# Altium project PROC114E3_SCH.PrjPcb (part 8 of 22)

## Sheet 20.SchDoc
size 513 x 386 mm
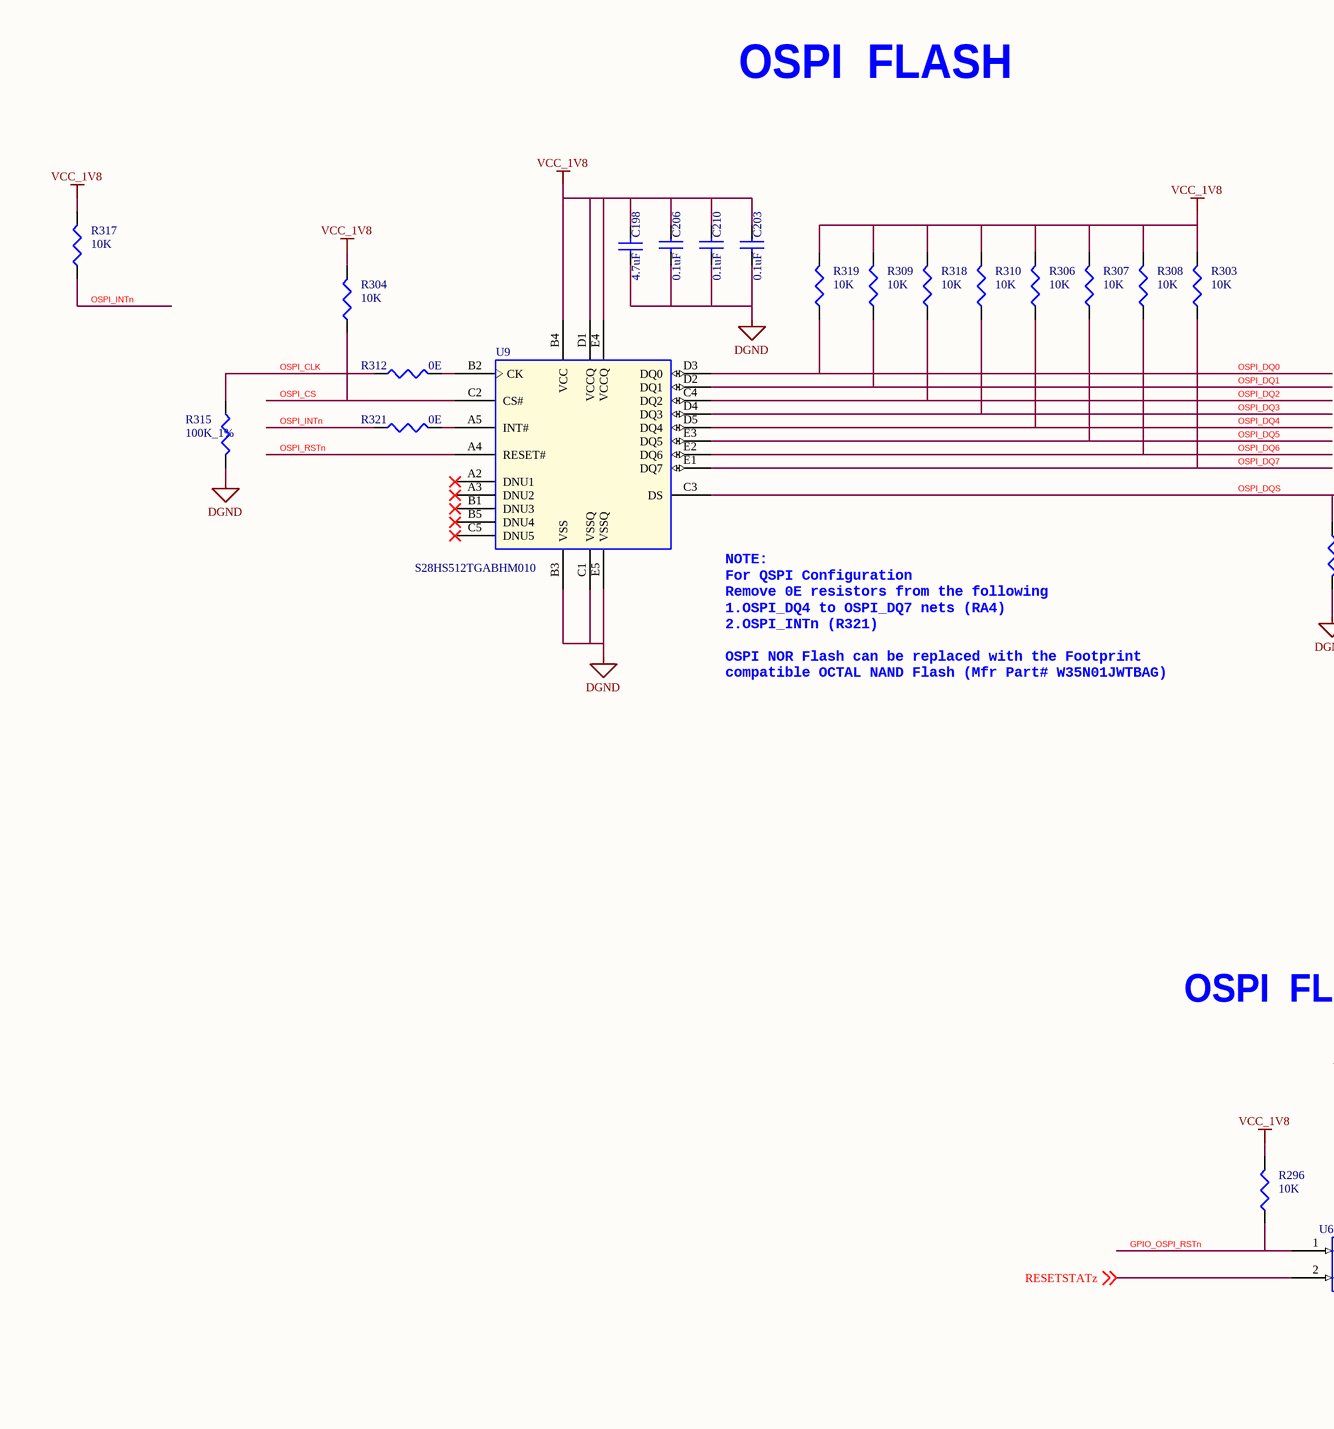
[diagram p30: 20.SchDoc, left]
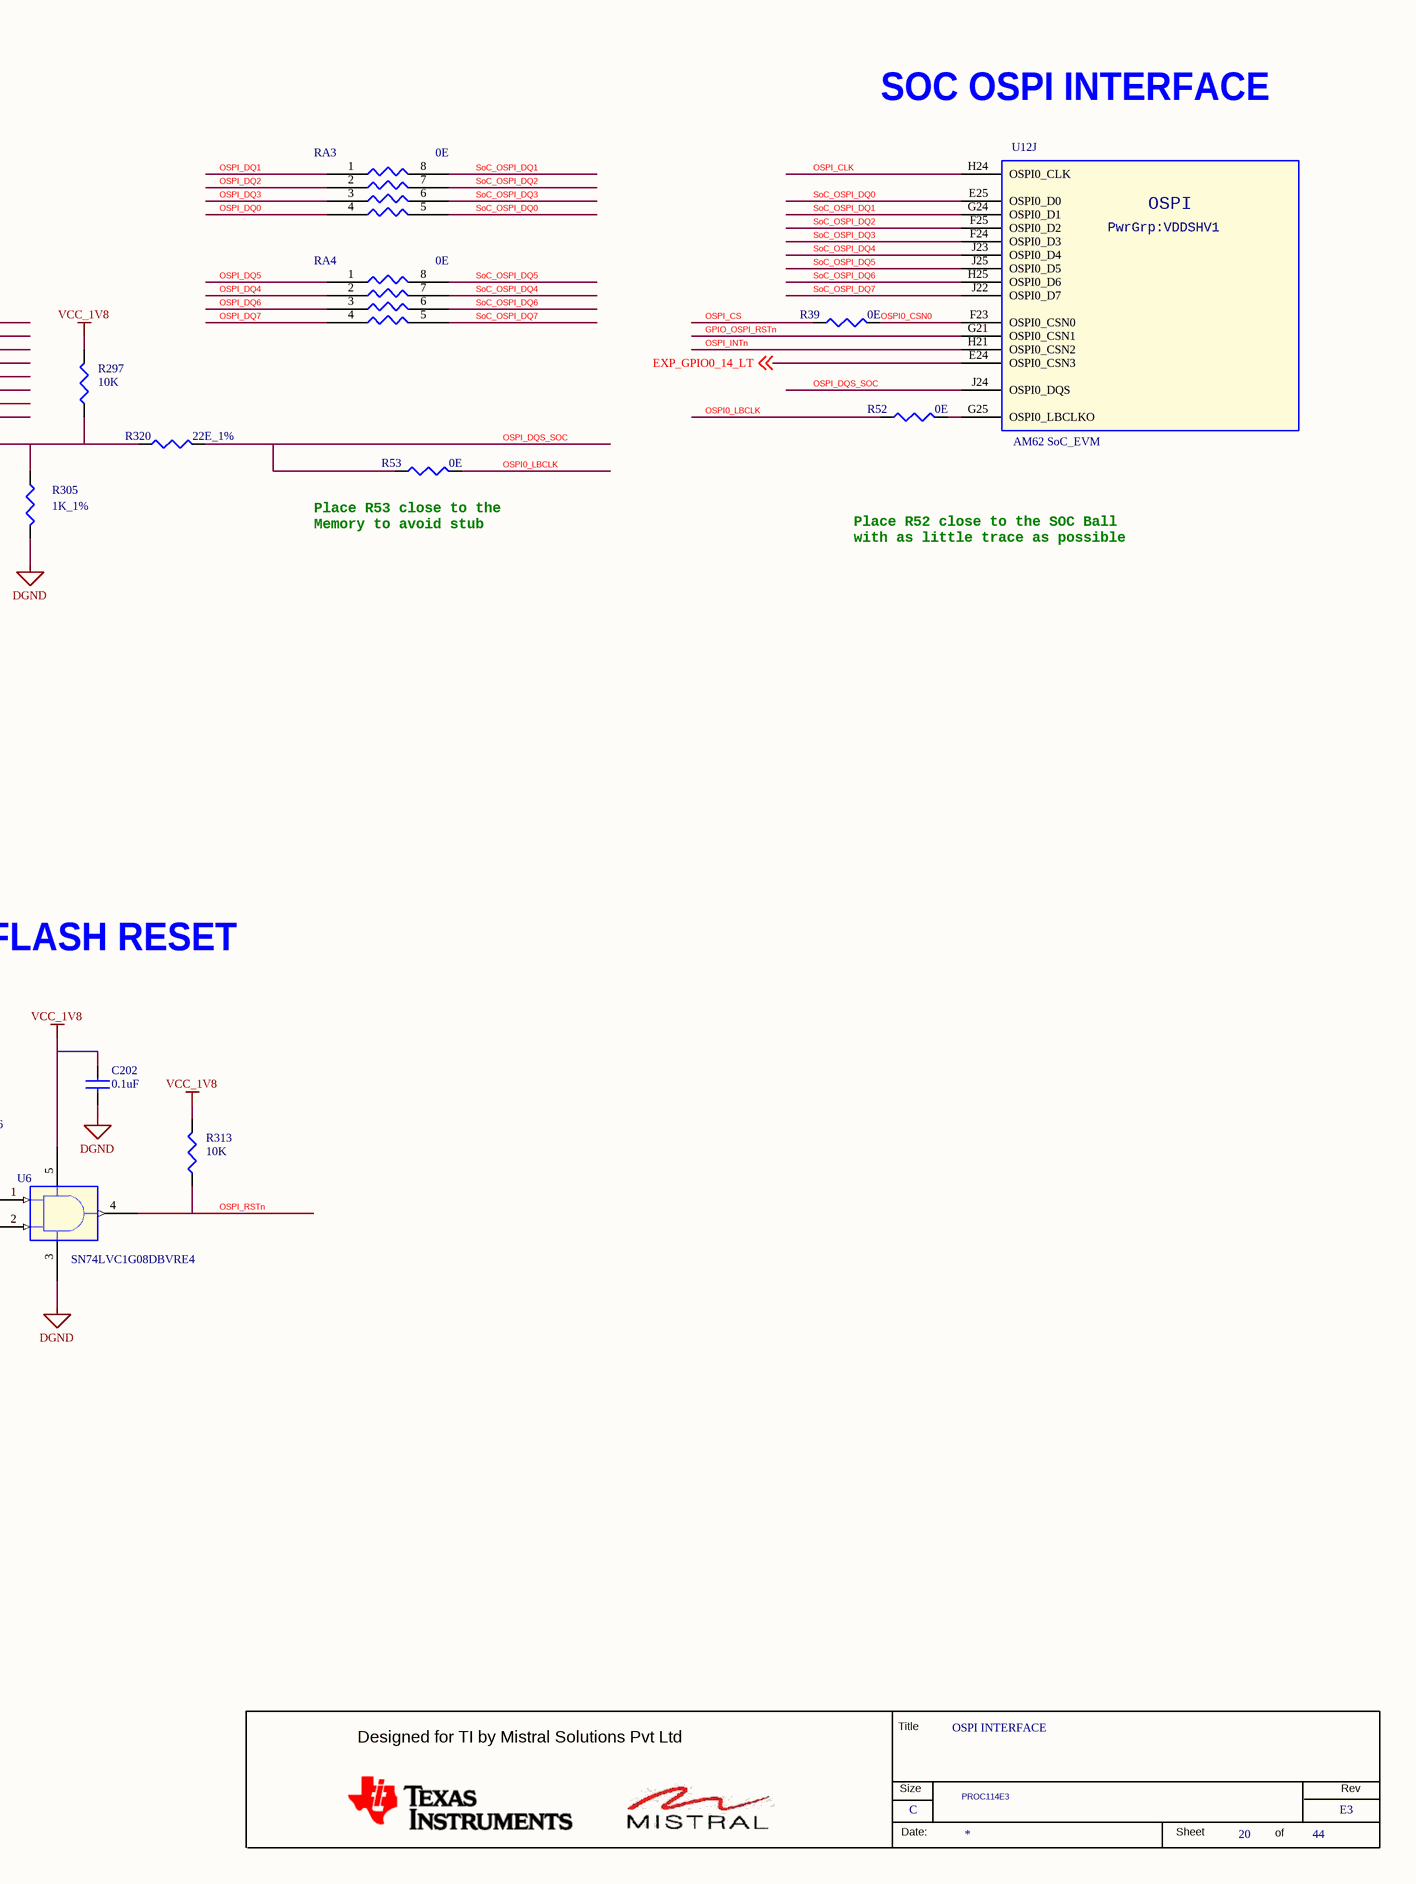
[diagram p31: 20.SchDoc, right]

### Parts
(Parts that share a designator on the sheet are numbered #1, #2 ... from top to bottom, then left to right.)
*#20  RevCode: E3  Title: OSPI INTERFACE  Page Size: C  Page Number: 20  Page Count: 44  Variant Name: PROC114E3  (hidden comment: MISTRAL_TITLEBLK_CSIZE)  (graphical)
C198  4.7uF  [CAP0402_0-75]
C202  0.1uF  [CAP0402_0-75]
C203  0.1uF  [CAP0402_0-75]
C206  0.1uF  [CAP0402_0-75]
C210  0.1uF  [CAP0402_0-75]
R39  0E  [RES0201_0-5]
R52  0E  [RES0201_0-5]
R53  0E  [RES0201_0-5]
R296  10K  [RES0201_0-5]
R297  10K  [RES0201_0-5]
R303  10K  [RES0201_0-5]
R304  10K  [RES0201_0-5]
R305  1K_1%  [RES0402_0-5]
R306  10K  [RES0201_0-5]
R307  10K  [RES0201_0-5]
R308  10K  [RES0201_0-5]
R309  10K  [RES0201_0-5]
R310  10K  [RES0201_0-5]
R312  0E  [RES0402_0-5]
R313  10K  [RES0201_0-5]
R315  100K_1%  [RES0201_0-5]
R317  10K  [RES0201_0-5]
R318  10K  [RES0201_0-5]
R319  10K  [RES0201_0-5]
R320  22E_1%  [RES0201_0-5]
R321  0E  [RES0402_0-5]
RA3  0E  [RESA_EXB_0201-4_0-5]
RA4  0E  [RESA_EXB_0201-4_0-5]
U6  SN74LVC1G08DBVRE4  [SOT23-5]
U9  S28HS512TGABHM010  [BGA24_39-37_240X310_1]
U12#2  AM62 SoC_EVM  [BGA425_19-68_510X510_0-7]  (part J of 18)

### Nets
DGND: C198.1 C202.2 C203.2 C206.2 C210.2 R305.2 R315.2 U6.3(GND) U9.B3(VSS) U9.C1(VSSQ) U9.E5(VSSQ)
VCC_1V8: C198.2 C202.1 C203.1 C206.1 C210.1 R296.2 R297.2 R303.2 R304.2 R306.2 R307.2 R308.2 R309.2 R310.2 R313.2 R317.2 R318.2 R319.2 U6.5(VCC) U9.B4(VCC) U9.D1(VCCQ) U9.E4(VCCQ)
EXP_GPIO0_14_LT: U12#2.E24(OSPI0_CSN3) ; off-sheet EXP_GPIO0_14_LT
GPIO_OSPI_RSTn: R296.1 U6.1(A) U12#2.G21(OSPI0_CSN1)
OSPI0_CSN0: R39.2 U12#2.F23(OSPI0_CSN0)
OSPI0_LBCLK: R52.1 R53.2
OSPI_CLK: R312.1 R315.1 U12#2.H24(OSPI0_CLK)
OSPI_CS: R39.1 R304.1 U9.C2(CS#)
OSPI_DQ0: R319.1 RA3.4 U9.D3(DQ0)
OSPI_DQ1: R309.1 RA3.1 U9.D2(DQ1)
OSPI_DQ2: R318.1 RA3.2 U9.C4(DQ2)
OSPI_DQ3: R310.1 RA3.3 U9.D4(DQ3)
OSPI_DQ4: R306.1 RA4.2 U9.D5(DQ4)
OSPI_DQ5: R307.1 RA4.1 U9.E3(DQ5)
OSPI_DQ6: R308.1 RA4.3 U9.E2(DQ6)
OSPI_DQ7: R303.1 RA4.4 U9.E1(DQ7)
OSPI_DQS: R297.1 R305.1 R320.1 U9.C3(DS)
OSPI_DQS_SOC: R53.1 R320.2 U12#2.J24(OSPI0_DQS)
OSPI_INTn: R317.1 R321.1 U12#2.H21(OSPI0_CSN2)
OSPI_RSTn: R313.1 U6.4(Y) U9.A4(RESET#)
RESETSTATz: U6.2(B) ; off-sheet RESETSTATz
SoC_OSPI_DQ0: RA3.5 U12#2.E25(OSPI0_D0)
SoC_OSPI_DQ1: RA3.8 U12#2.G24(OSPI0_D1)
SoC_OSPI_DQ2: RA3.7 U12#2.F25(OSPI0_D2)
SoC_OSPI_DQ3: RA3.6 U12#2.F24(OSPI0_D3)
SoC_OSPI_DQ4: RA4.7 U12#2.J23(OSPI0_D4)
SoC_OSPI_DQ5: RA4.8 U12#2.J25(OSPI0_D5)
SoC_OSPI_DQ6: RA4.6 U12#2.H25(OSPI0_D6)
SoC_OSPI_DQ7: RA4.5 U12#2.J22(OSPI0_D7)
NetR52_2: R52.2 U12#2.G25(OSPI0_LBCLKO)
NetR312_2: R312.2 U9.B2(CK)
NetR321_2: R321.2 U9.A5(INT#)

Not connected (* = marked no-connect by the designer): U9 A2(DNU1)* A3(DNU2)* B1(DNU3)* B5(DNU4)* C5(DNU5)*

### Notes on the sheet
- OSPI  FLASH
- SOC OSPI INTERFACE
- NOTE:
  For QSPI Configuration
  Remove 0E resistors from the following
  1.OSPI_DQ4 to OSPI_DQ7 nets (RA4)
  2.OSPI_INTn (R321)
  OSPI NOR Flash can be replaced with the Footprint
  compatible OCTAL NAND Flash (Mfr Part# W35N01JWTBAG)
- (near R53) Place R53 close to the
  Memory to avoid stub
- Place R52 close to the SOC Ball
  with as little trace as possible
- OSPI  FLASH RESET
- (in symbol AM62-EVM_BGA425, part J) OSPI; PwrGrp:VDDSHV1
- (in symbol MISTRAL_TITLEBLK_CSIZE) Title; Designed for TI by Mistral Solutions Pvt Ltd; Size; Rev; Date:; Sheet; of

### Library data of the parts
*#20 = MISTRAL_TITLEBLK_CSIZE: Issue: 1.0; Page Create Date: March  8, 1995; Page Modify Date: *; Schematic Page Count: 44; Schematic Page Number: 20
C198 = CAP_Dup2: CAP CERAMIC 4.7uF 10V 20% X5R 0402; Part_type: CAPACITORS\CERAMIC; Mfr_part_number: GRM155R61A475MEAAD; Mfr_name: MURATA; Mistral Part No: 120012060002-R; Custom_Duty: 15%; Customs_HS_Code: 85322990; Wattage: NA; Project: TI_J7SVB_PCIE_ADD-ON-CARD; Footprint Path: Y:\MIS_DATABASE\Library\ALTIUM_TOOL\PCB_FOOTPRINTS\Altium_Footprint_Lib.PcbLib; Library Path: Y:\MIS_DATABASE\Library\ALTIUM_TOOL\SCHEMATICS_PARTS\MS_DISCRETE_Library.schlib; Footprint Ref: CAP0402_0-75; Library Ref: CAP; MECHANICAL 3D STEP FILE: CAP0402_0-75; Chkd/date: MANIRAJA/110718; Crtd /date: ALVY/110718; Datasheet: Y:\MIS_DATABASE\DATASHEETS\CAPACITORS\GRM155R61A475MEAAD.PDF; Temperature: -55°C+85°C; Weight: 14mg; Height: 0.65MM; Distributor_part_number: 490-14306-1-ND; Distributor_name: DIGIKEY; Package: 0402; Voltage: 10V; Tolerance: 20%; PCB Footprint: CAP0402_0-75
C202 C203 C206 = CAP_Dup2: as C335 on sheet 18; Footprint Path: Y:\MIS_DATABASE\Library\ALTIUM_TOOL\PCB_FOOTPRINTS\Altium_Footprint_Lib.PcbLib; Library Path: Y:\MIS_DATABASE\Library\ALTIUM_TOOL\SCHEMATICS_PARTS\MS_DISCRETE_Library.schlib; Footprint Ref: CAP0402_0-75; Library Ref: CAP; MECHANICAL 3D STEP FILE: CAP0402_0-75; Chkd/date: MANIRAJA/261020; Crtd /date: ALVY/211020; Datasheet: Y:\MIS_DATABASE\DATASHEETS\CAPACITORS\GRM155R71H104KE14.PDF; Temperature: -55°C+125°C; Weight: 3.1mg; Height: 0.55MM; Distributor_part_number: 490-10700-1-ND; Distributor_name: DIGIKEY; Package: 0402; Voltage: 50V; Tolerance: 10%; PCB Footprint: CAP0402_0-75
C210 = CAP_Dup2: as C331 on sheet 18; Tolerance: 10%; Voltage: 50V; Package: 0402; Distributor_name: DIGIKEY; Distributor_part_number: 490-10700-1-ND; Height: 0.55MM; Weight: 3.1mg; Temperature: -55°C+125°C; Datasheet: Y:\MIS_DATABASE\DATASHEETS\CAPACITORS\GRM155R71H104KE14.PDF; Crtd /date: ALVY/211020; Chkd/date: MANIRAJA/261020; MECHANICAL 3D STEP FILE: CAP0402_0-75; Library Ref: CAP; Footprint Ref: CAP0402_0-75; Library Path: Y:\MIS_DATABASE\Library\ALTIUM_TOOL\SCHEMATICS_PARTS\MS_DISCRETE_Library.schlib; Footprint Path: Y:\MIS_DATABASE\Library\ALTIUM_TOOL\PCB_FOOTPRINTS\Altium_Footprint_Lib.PcbLib; PCB Footprint: CAP0402_0-75
R39 R52 = RESISTOR_Dup6: RES 0E 1/20W 5% 0201; Mistral Part No: 110010070067-R; Mfr_name: YAGEO AMERICA; Mfr_part_number: RC0201JR-070RL; Part_type: RESISTORS\FIXED; Project: PB_BUGBASE; Voltage: NA; Customs_HS_Code: 85332119; Custom_Duty: 15%; SIGNAL_MODEL: RESISTOR_RES0201_0-5_0E_0E; Footprint Ref: RES0201_0-5; Tolerance: 5%; Wattage: 1/20W; Package: 0201; Distributor_name: DIGIKEY; Distributor_part_number: 311-0.0NCT-ND; Library Ref: RESISTOR; Height: 0.26MM; Weight: 0.17mg; Temperature: -55°C+125°C; Datasheet: Y:\MIS_DATABASE\DATASHEETS\RESISTORS\RCXXXXL-SER_MAR18.PDF; Crtd /date: MUDDU/120710; Chkd/date: NAVEED/301214; MECHANICAL 3D STEP FILE: RES0201_0-5; Library Path: Y:\MIS_DATABASE\Library\ALTIUM_TOOL\SCHEMATICS_PARTS\MS_DISCRETE_Library.schlib; Footprint Path: Y:\MIS_DATABASE\Library\ALTIUM_TOOL\PCB_FOOTPRINTS\Altium_Footprint_Lib.PcbLib; PCB Footprint: RES0201_0-5
R53 = RESISTOR_Dup6: RES 0E 1/20W 5% 0201; Part_type: RESISTORS\FIXED; Mfr_part_number: RC0201JR-070RL; Mfr_name: YAGEO AMERICA; Mistral Part No: 110010070067-R; Custom_Duty: 15%; Customs_HS_Code: 85332119; Voltage: NA; Project: PB_BUGBASE; SIGNAL_MODEL: RESISTOR_RES0201_0-5_0E_0E; Footprint Path: Y:\MIS_DATABASE\Library\ALTIUM_TOOL\PCB_FOOTPRINTS\Altium_Footprint_Lib.PcbLib; Library Path: Y:\MIS_DATABASE\Library\ALTIUM_TOOL\SCHEMATICS_PARTS\MS_DISCRETE_Library.schlib; MECHANICAL 3D STEP FILE: RES0201_0-5; Chkd/date: NAVEED/301214; Crtd /date: MUDDU/120710; Datasheet: Y:\MIS_DATABASE\DATASHEETS\RESISTORS\RCXXXXL-SER_MAR18.PDF; Temperature: -55°C+125°C; Weight: 0.17mg; Height: 0.26MM; Library Ref: RESISTOR; Distributor_part_number: 311-0.0NCT-ND; Distributor_name: DIGIKEY; Package: 0201; Wattage: 1/20W; Tolerance: 5%; Footprint Ref: RES0201_0-5; PCB Footprint: RES0201_0-5
R296 R297 R304 R313 R317 = RESISTOR_Dup6: as R427 on sheet 18; MECHANICAL 3D STEP FILE: RES0201_0-5; Chkd/date: MANIRAJA/050517; Crtd /date: MANIRAJA/050517; Datasheet: Y:\MIS_DATABASE\DATASHEETS\RESISTORS\RCXXXXL-SER_MAR18.PDF; Temperature: -55°C+125°C; Weight: 0.17mg; Height: 0.26MM; Distributor_part_number: 311-10KNCT-ND; Distributor_name: DIGIKEY; Package: 0201; Wattage: 1/20W; Tolerance: 5%; Library Ref: RESISTOR; Footprint Ref: RES0201_0-5; Library Path: Y:\MIS_DATABASE\Library\ALTIUM_TOOL\SCHEMATICS_PARTS\MS_DISCRETE_Library.schlib; Footprint Path: Y:\MIS_DATABASE\Library\ALTIUM_TOOL\PCB_FOOTPRINTS\Altium_Footprint_Lib.PcbLib; PCB Footprint: RES0201_0-5
R303 R306-R310 R318 R319 = RESISTOR_Dup6: as R117 on sheet 19; Footprint Path: Y:\MIS_DATABASE\Library\ALTIUM_TOOL\PCB_FOOTPRINTS\Altium_Footprint_Lib.PcbLib; Library Path: Y:\MIS_DATABASE\Library\ALTIUM_TOOL\SCHEMATICS_PARTS\MS_DISCRETE_Library.schlib; Footprint Ref: RES0201_0-5; Library Ref: RESISTOR; Tolerance: 5%; Wattage: 1/20W; Package: 0201; Distributor_name: DIGIKEY; Distributor_part_number: 311-10KNCT-ND; Height: 0.26MM; Weight: 0.17mg; Temperature: -55°C+125°C; Datasheet: Y:\MIS_DATABASE\DATASHEETS\RESISTORS\RCXXXXL-SER_MAR18.PDF; Crtd /date: MANIRAJA/050517; Chkd/date: MANIRAJA/050517; MECHANICAL 3D STEP FILE: RES0201_0-5; PCB Footprint: RES0201_0-5
R305 = RESISTOR_Dup4: RES 1K 1/10W 1% 0402; Mistral Part No: 110009030411-R; Mfr_name: PANASONIC-ECG; Mfr_part_number: ERJ-2RKF1001X; Part_type: RESISTORS\FIXED; Project: VOCERA; Voltage: NA; Customs_HS_Code: 85332119; Custom_Duty: 15%; Footprint Path: Y:\MIS_DATABASE\Library\ALTIUM_TOOL\PCB_FOOTPRINTS\Altium_Footprint_Lib.PcbLib; Library Path: Y:\MIS_DATABASE\Library\ALTIUM_TOOL\SCHEMATICS_PARTS\MS_DISCRETE_Library.schlib; MECHANICAL 3D STEP FILE: RES0402_0-5; Footprint Ref: RES0402_0-5; Library Ref: RESISTOR; Tolerance: 1%; Wattage: 1/10W; Package: 0402; Distributor_name: DIGIKEY; Distributor_part_number: P1.00KLCT-ND; Height: 0.40MM; Weight: 0.8mg; Temperature: -55°C+155°C; Datasheet: Y:\MIS_DATABASE\DATASHEETS\RESISTORS\PAN-ERJSER_NOV17.PDF; Crtd /date: MAZHAR/150506; Chkd/date: VASANTHA/281216; PCB Footprint: RES0402_0-5
R312 = RESISTOR_Dup6: RES 0E 1/16W JUMPER 0402; Mistral Part No: 110010080019-R; Mfr_name: VISHAY; Mfr_part_number: CRCW04020000Z0ED; Part_type: RESISTORS\FIXED; Project: PB_BUGBASE; Tolerance: NA; Customs_HS_Code: 85332119; Custom_Duty: 15%; SIGNAL_MODEL: RESISTOR_RES0402_0-5_0E_0E; Footprint Ref: RES0402_0-5; Voltage: NA; Wattage: 1/16W; Package: 0402; Distributor_name: DIGIKEY; Distributor_part_number: 541-0.0JCT-ND; Library Ref: RESISTOR; Height: 0.40MM; Weight: 0.65mg; Temperature: -55°C+155°C; Datasheet: Y:\MIS_DATABASE\DATASHEETS\RESISTORS\CRCW0603.PDF; Crtd /date: MUDDU/190810; Chkd/date: VASANTHA/201216; MECHANICAL 3D STEP FILE: RES0402_0-5; Library Path: Y:\MIS_DATABASE\Library\ALTIUM_TOOL\SCHEMATICS_PARTS\MS_DISCRETE_Library.schlib; Footprint Path: Y:\MIS_DATABASE\Library\ALTIUM_TOOL\PCB_FOOTPRINTS\Altium_Footprint_Lib.PcbLib; PCB Footprint: RES0402_0-5
R315 = RESISTOR_Dup6: RES 100K 1/20W 1% 0201; Part_type: RESISTORS\FIXED; Mfr_part_number: RC0201FR-07100KL; Mfr_name: YAGEO AMERICA; Mistral Part No: 110009060005-R; Custom_Duty: 15%; Customs_HS_Code: 85332119; Voltage: NA; Project: SD865_NANOSOM; Footprint Path: Y:\MIS_DATABASE\Library\ALTIUM_TOOL\PCB_FOOTPRINTS\Altium_Footprint_Lib.PcbLib; Library Path: Y:\MIS_DATABASE\Library\ALTIUM_TOOL\SCHEMATICS_PARTS\MS_DISCRETE_Library.schlib; MECHANICAL 3D STEP FILE: RES0201_0-5; Chkd/date: MANIRAJA/120520; Crtd /date: ALVY/120520; Datasheet: Y:\MIS_DATABASE\DATASHEETS\RESISTORS\RCXXXXL-SER_MAR18.PDF; Temperature: -55°C+125°C; Weight: 9mg; Height: 0.26MM; Library Ref: RESISTOR; Distributor_part_number: 311-100KMCT-ND; Distributor_name: DIGIKEY; Package: 0201; Wattage: 1/20W; Tolerance: 1%; Footprint Ref: RES0201_0-5; PCB Footprint: RES0201_0-5
R320 = RESISTOR_Dup6: RES 22E 1/20W 1% 0201; Mistral Part No: 110009030522-R; Mfr_name: YAGEO AMERICA; Mfr_part_number: RC0201FR-0722RL; Part_type: RESISTORS\FIXED; Project: AM654x_SOM; Voltage: NA; Customs_HS_Code: 85332119; Custom_Duty: 15%; SIGNAL_MODEL: RESISTOR_RES0201_0-5_22E_1%_22E_1%; Footprint Ref: RES0201_0-5; Tolerance: 1%; Wattage: 1/20W; Package: 0201; Distributor_name: DIGIKEY; Distributor_part_number: YAG2518CT-ND; Library Ref: RESISTOR; Height: 0.26MM; Weight: 0.17mg; Temperature: -55°C+125°C; Datasheet: Y:\MIS_DATABASE\DATASHEETS\RESISTORS\RCXXXXL-SER_MAR18.PDF; Crtd /date: ALVY/080319; Chkd/date: MANIRAJA/080319; MECHANICAL 3D STEP FILE: RES0201_0-5; Library Path: Y:\MIS_DATABASE\Library\ALTIUM_TOOL\SCHEMATICS_PARTS\MS_DISCRETE_Library.schlib; Footprint Path: Y:\MIS_DATABASE\Library\ALTIUM_TOOL\PCB_FOOTPRINTS\Altium_Footprint_Lib.PcbLib; PCB Footprint: RES0201_0-5
R321 = RESISTOR_Dup6: RES 0E 1/16W JUMPER 0402; Part_type: RESISTORS\FIXED; Mfr_part_number: CRCW04020000Z0ED; Mfr_name: VISHAY; Mistral Part No: 110010080019-R; Custom_Duty: 15%; Customs_HS_Code: 85332119; Voltage: NA; Project: PB_BUGBASE; Footprint Path: Y:\MIS_DATABASE\Library\ALTIUM_TOOL\PCB_FOOTPRINTS\Altium_Footprint_Lib.PcbLib; Library Path: Y:\MIS_DATABASE\Library\ALTIUM_TOOL\SCHEMATICS_PARTS\MS_DISCRETE_Library.schlib; MECHANICAL 3D STEP FILE: RES0402_0-5; Chkd/date: VASANTHA/201216; Crtd /date: MUDDU/190810; Datasheet: Y:\MIS_DATABASE\DATASHEETS\RESISTORS\CRCW0603.PDF; Temperature: -55°C+155°C; Weight: 0.65mg; Height: 0.40MM; Library Ref: RESISTOR; Distributor_part_number: 541-0.0JCT-ND; Distributor_name: DIGIKEY; Package: 0402; Wattage: 1/16W; Tolerance: NA; Footprint Ref: RES0402_0-5; PCB Footprint: RES0402_0-5
RA3 = RESARR_ISO4: RES ARRAY 0E 31mW JUMPER 0201-4; Mistral Part No: 110018090033-R; Manufacturer: PANASONIC-ECG; Mfr_part_number: EXB-18VR000X; Part_type: RESISTORS\ARRAY; Project: TI_60GHz-AOP; Tolerance: NA; Customs_HS_Code: 85332119; Custom_Duty: 15%; PCB Footprint: RESA_EXB_0201-4_0-5; Footprint Ref: RESA_EXB_0201-4_0-5; Voltage: NA; Wattage: 31mW; Package: 0201-4; Distributor_name: DIGIKEY; Distributor_part_number: Y6000CT-ND; Library Ref: RESARR_ISO4; Height: 0.45MM; Weight: 1mg; Temperature: -55°C+125°C; Datasheet: Y:\MIS_DATABASE\DATASHEETS\RESISTORS\EXB-18V.PDF; Crtd /date: MANIRAJA/290918; Chkd/date: MANIRAJA/290918; MECHANICAL 3D STEP FILE: RESA_EXB_0201-4_0-5; Library Path: Y:\MIS_DATABASE\Library\ALTIUM_TOOL\SCHEMATICS_PARTS\MS_DISCRETE_Library.schlib; Footprint Path: Y:\MIS_DATABASE\Library\ALTIUM_TOOL\PCB_FOOTPRINTS\Altium_Footprint_Lib.PcbLib
RA4 = RESARR_ISO4: RES ARRAY 0E 31mW JUMPER 0201-4; Part_type: RESISTORS\ARRAY; Mfr_part_number: EXB-18VR000X; Manufacturer: PANASONIC-ECG; Mistral Part No: 110018090033-R; Custom_Duty: 15%; Customs_HS_Code: 85332119; Voltage: NA; Project: TI_60GHz-AOP; PCB Footprint: RESA_EXB_0201-4_0-5; Footprint Path: Y:\MIS_DATABASE\Library\ALTIUM_TOOL\PCB_FOOTPRINTS\Altium_Footprint_Lib.PcbLib; Library Path: Y:\MIS_DATABASE\Library\ALTIUM_TOOL\SCHEMATICS_PARTS\MS_DISCRETE_Library.schlib; MECHANICAL 3D STEP FILE: RESA_EXB_0201-4_0-5; Chkd/date: MANIRAJA/290918; Crtd /date: MANIRAJA/290918; Datasheet: Y:\MIS_DATABASE\DATASHEETS\RESISTORS\EXB-18V.PDF; Temperature: -55°C+125°C; Weight: 1mg; Height: 0.45MM; Library Ref: RESARR_ISO4; Distributor_part_number: Y6000CT-ND; Distributor_name: DIGIKEY; Package: 0201-4; Wattage: 31mW; Tolerance: NA; Footprint Ref: RESA_EXB_0201-4_0-5
U6 = SN74LVC1G08DBVRE4_SOT23-5_Dup1: IC SINGLE 2-INPUT POSITIVE AND GATE SOT23-5; Part_type: ICS\DIGITAL\GATES; Mfr_name: TEXAS INSTRUMENTS; Mistral Part No: 141009060026-R; Custom_Duty: 15%; Customs_HS_Code: 85423100; Project: KHAN_MAIN; RoHS: Sb/ Br FREE; Chkd/date: SUHAS/221010; Crtd /date: USMAN/151008; Datasheet: Y:\MIS_DATABASE\DATASHEETS\ICS\DIGITAL\GATES\SN74LVC1G08.PDF; Temperature: -40°C+85°C; Height: 1.45MM; Library Ref: SN74LVC1G08DBVRE4_SOT23-5; Distributor_part_number: SN74LVC1G08DBVRE4-ND; Distributor_name: DIGIKEY; Package: SOT23-5; Mfr_part_number: SN74LVC1G08DBVRE4; PCB Footprint: SOT23-5
U9 = S28HS512T_BGA24: IC 1.8V 512Mb SEMPER FLASH WITH OCTAL INTERFACE BGA24; Part_type: ICS\DIGITAL\MEMORY; Mfr_name: CYPRESS SEMICONDUCTOR; Mistral Part No: 141120010002; Custom_Duty: 15%; Customs_HS_Code: 85423100; Wattage: NA; Project: J7VCL_SOM DUAL LEO PMIC; Footprint Path: Y:\MIS_DATABASE\Library\ALTIUM_TOOL\PCB_FOOTPRINTS\Altium_Footprint_Lib.PcbLib; Library Path: Y:\MIS_DATABASE\Library\ALTIUM_TOOL\SCHEMATICS_PARTS\MS_MISCMEMORY_Library.schlib; MECHANICAL 3D STEP FILE: BGA24_39-37_240X310_1; RoHS: NA; Chkd/date: MANIRAJA/170120; Crtd /date: ALVY/170120; Datasheet: Y:\MIS_DATABASE\DATASHEETS\ICS\MEMORY\S28HS512T.PDF; Temperature: -40°C+125°C; Weight: NA; Height: 1.00MM; Library Ref: S28HS512T_BGA24; Distributor_part_number: NA; Distributor_name: NA; Package: BGA24; Voltage: NA; Tolerance: NA; Mfr_part_number: S28HS512TGABHM010; Footprint Ref: BGA24_39-37_240X310_1; PCB Footprint: BGA24_39-37_240X310_1
U12#2 = AM62-EVM_BGA425: as U12#2 on sheet 18; Mfr_part_number: AM62 SoC_EVM; Voltage: NA; Wattage: NA; Package: BGA425; Distributor_name: NA; Distributor_part_number: NA; Library Ref: AM62-EVM_BGA425; Footprint Ref: BGA425_19-68_510X510_0-7; Height: 0.65MM; Weight: NA; Temperature: NA; Datasheet: Y:\MIS_DATABASE\DATASHEETS\ICS\DIGITAL\MICROCONTROLLER\AM62-SoC_SVB.PDF; Crtd /date: MANIRAJA/110621; Chkd/date: ALVY/110621; RoHS: NA; MECHANICAL 3D STEP FILE: BGA425_19-68_510X510_0-7; Library Path: Y:\MIS_DATABASE\Library\ALTIUM_TOOL\SCHEMATICS_PARTS\MS_MICROPROCESSOR_Library.schlib; Footprint Path: Y:\MIS_DATABASE\Library\ALTIUM_TOOL\PCB_FOOTPRINTS\Altium_Footprint_Lib.PcbLib; PCB Footprint: BGA425_19-68_510X510_0-7

## Sheet 21.SchDoc
size 513 x 386 mm
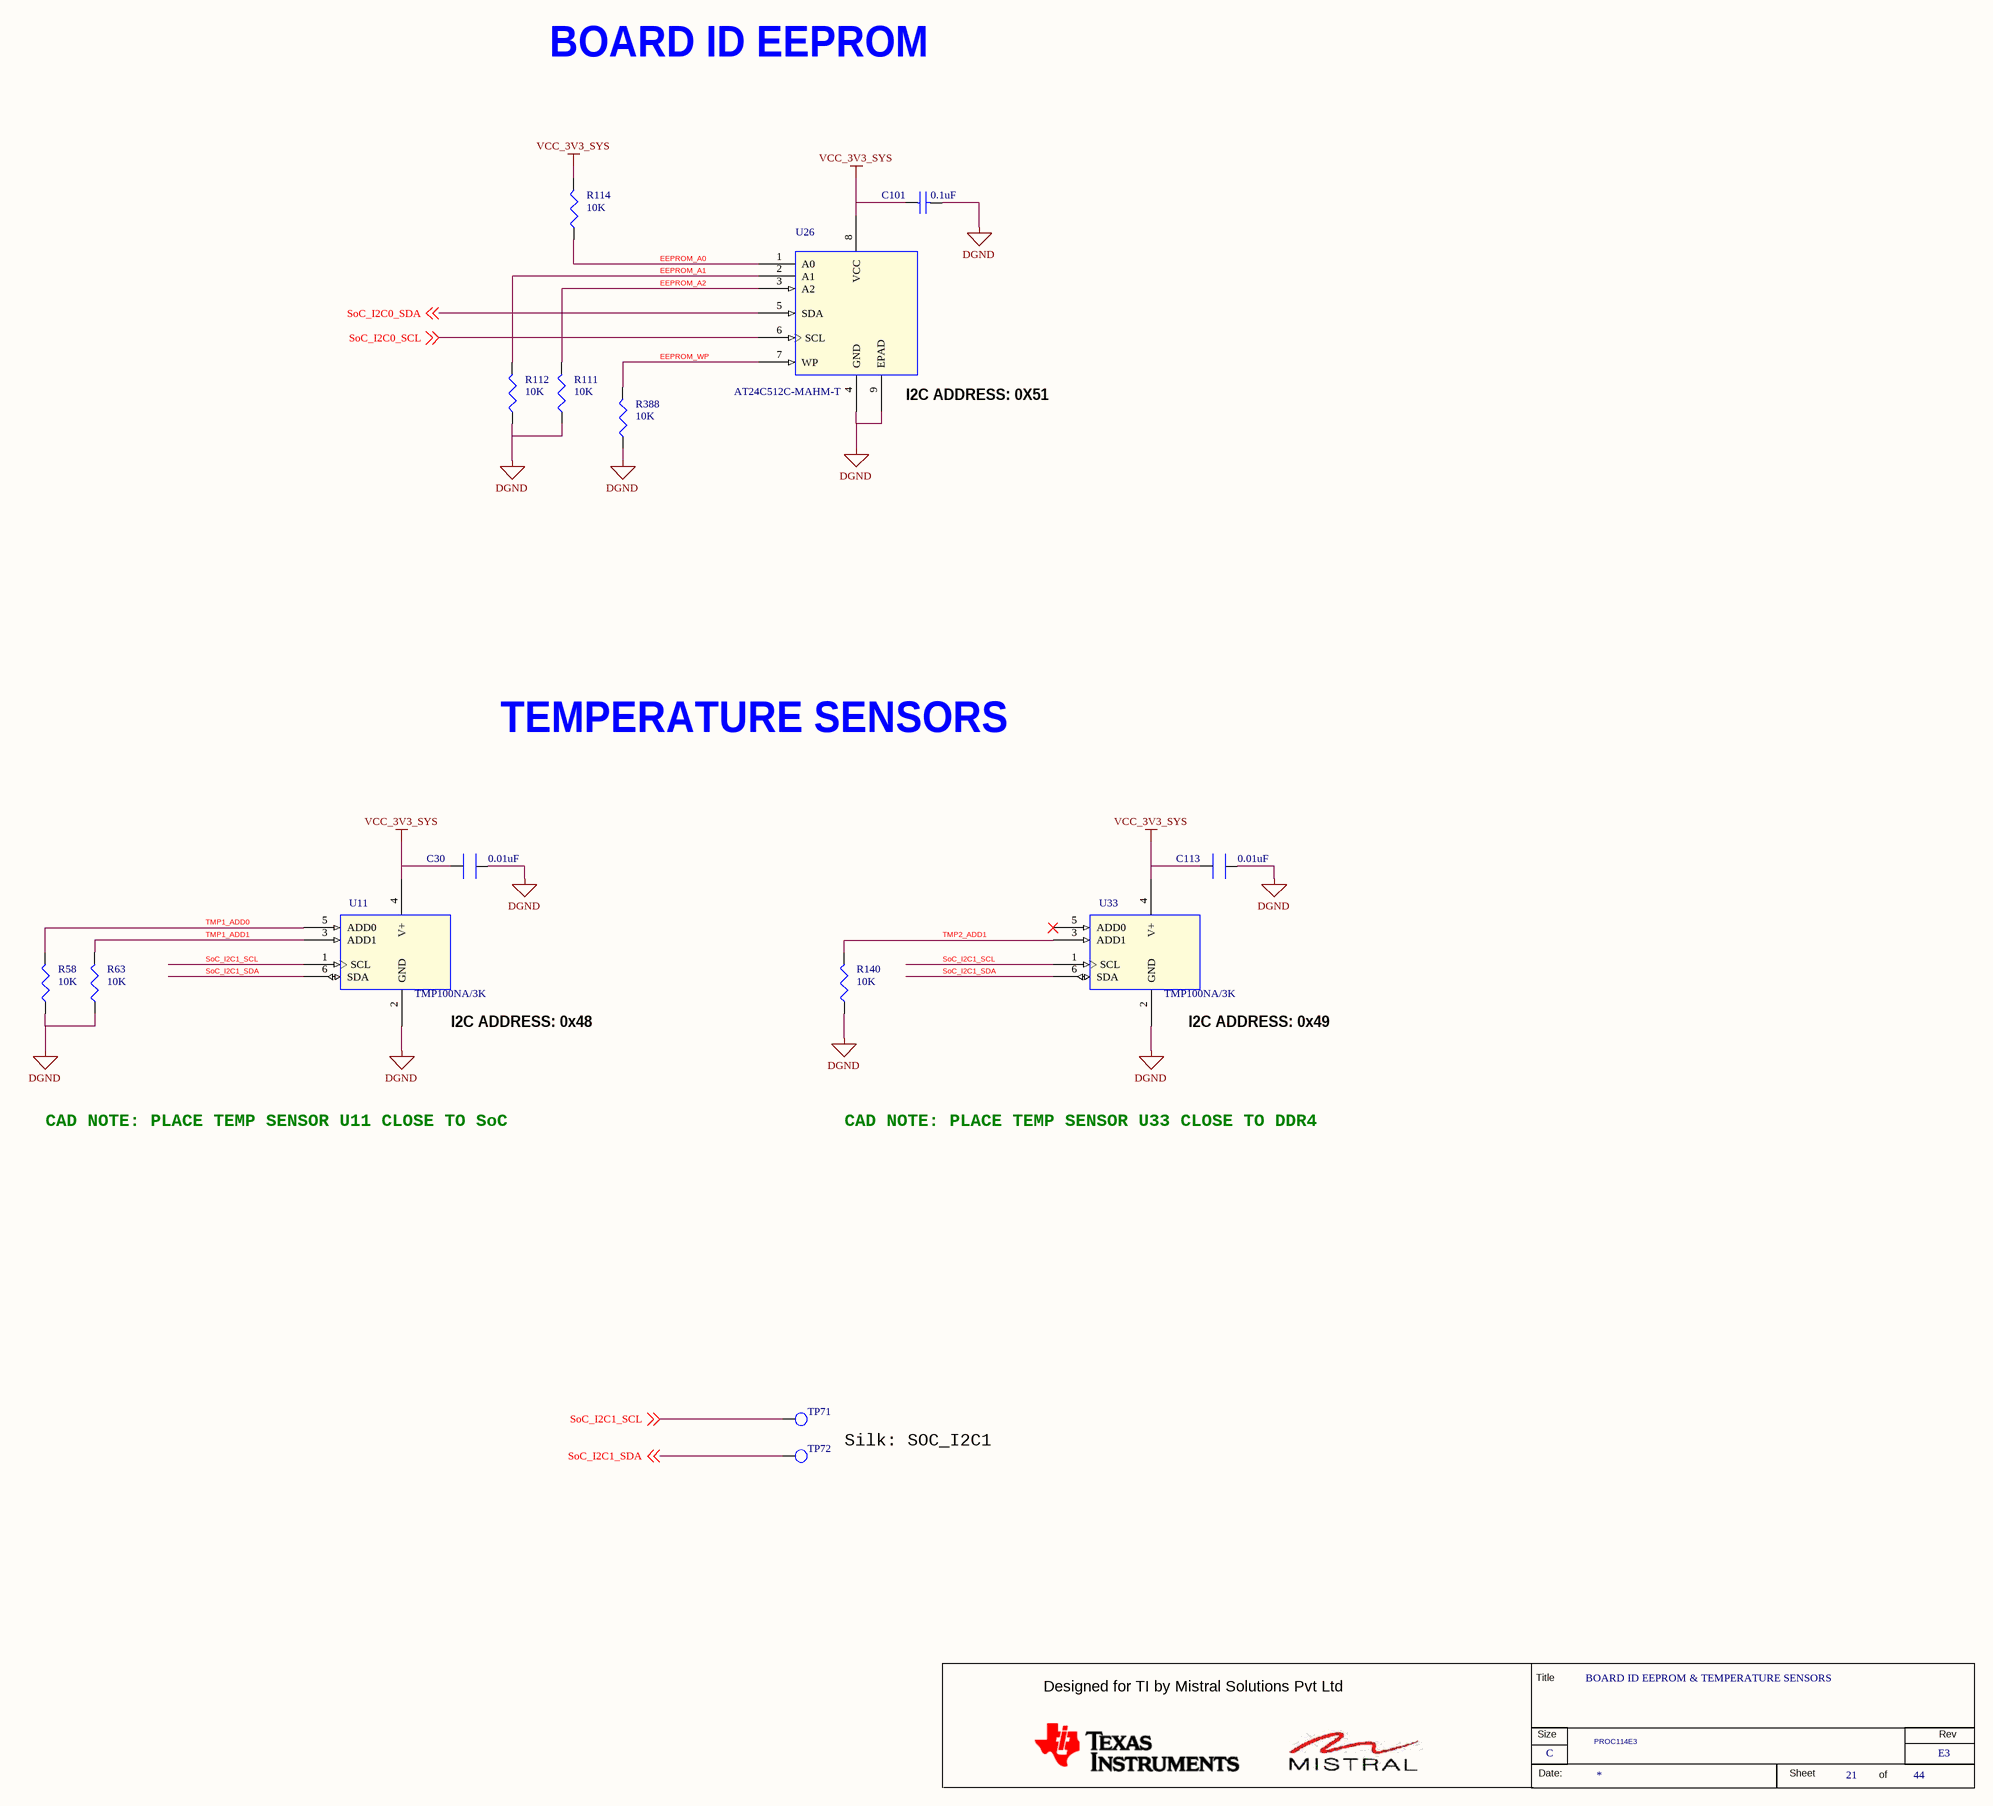
[diagram p32: 21.SchDoc]

### Parts
(Parts that share a designator on the sheet are numbered #1, #2 ... from top to bottom, then left to right.)
*#21  RevCode: E3  Title: BOARD ID EEPROM & TEMPERATURE SENSORS  Page Size: C  Page Number: 21  Page Count: 44  Variant Name: PROC114E3  (hidden comment: MISTRAL_TITLEBLK_CSIZE)  (graphical)
C30  0.01uF  [CAP0402N]
C101  0.1uF  [CAP0402_0-75]
C113  0.01uF  [CAP0402N]
R58  10K  [RES0201_0-5]
R63  10K  [RES0201_0-5]
R111  10K  [RES0201_0-5]
R112  10K  [RES0201_0-5]
R114  10K  [RES0201_0-5]
R140  10K  [RES0201_0-5]
R388  10K  [RES0201_0-5]
TP71  THRU HOLE  [TP_36X22]  (value not drawn)
TP72  THRU HOLE  [TP_36X22]  (value not drawn)
U11  TMP100NA/3K  [SOT23-6_1-5]
U26  AT24C512C-MAHM-T  [UDFN8_19-68_120X80_0-6]
U33  TMP100NA/3K  [SOT23-6_1-5]

### Nets
DGND: C30.1 C101.2 C113.1 R58.2 R63.2 R111.2 R112.2 R140.2 R388.2 U11.2(GND) U26.4(GND) U26.9(EPAD) U33.2(GND)
VCC_3V3_SYS: C30.2 C101.1 C113.2 R114.1 U11.4(V+) U26.8(VCC) U33.4(V+)
EEPROM_A0: R114.2 U26.1(A0)
EEPROM_A1: R112.1 U26.2(A1)
EEPROM_A2: R111.1 U26.3(A2)
EEPROM_WP: R388.1 U26.7(WP)
SoC_I2C0_SCL: U26.6(SCL) ; off-sheet SoC_I2C0_SCL
SoC_I2C0_SDA: U26.5(SDA) ; off-sheet SoC_I2C0_SDA
SoC_I2C1_SCL: TP71.1(TP) U11.1(SCL) U33.1(SCL) ; off-sheet SoC_I2C1_SCL
SoC_I2C1_SDA: TP72.1(TP) U11.6(SDA) U33.6(SDA) ; off-sheet SoC_I2C1_SDA
TMP1_ADD0: R58.1 U11.5(ADD0)
TMP1_ADD1: R63.1 U11.3(ADD1)
TMP2_ADD1: R140.1 U33.3(ADD1)

Not connected (* = marked no-connect by the designer): U33 5(ADD0)*

### Notes on the sheet
- BOARD ID EEPROM
- (near U26) I2C ADDRESS: 0X51
- TEMPERATURE SENSORS
- I2C ADDRESS: 0x48
- (near U33) I2C ADDRESS: 0x49
- CAD NOTE: PLACE TEMP SENSOR U11 CLOSE TO SoC
- CAD NOTE: PLACE TEMP SENSOR U33 CLOSE TO DDR4
- Silk: SOC_I2C1
- (in symbol MISTRAL_TITLEBLK_CSIZE) Title; Designed for TI by Mistral Solutions Pvt Ltd; Size; Rev; Date:; Sheet; of

### Library data of the parts
*#21 = MISTRAL_TITLEBLK_CSIZE: Issue: 1.0; Page Create Date: March  8, 1995; Page Modify Date: *; Schematic Page Count: 44; Schematic Page Number: 21
C30 = CAP_Dup3: CAP CERAMIC 0.01uF 25V 10% X5R 0201; Part_type: CAPACITORS\CERAMIC; Mfr_part_number: GRM033R61E103KA12J; Mfr_name: MURATA; Mistral Part No: 120018010007-R; PCB Footprint: CAP0201_0-5; Wattage: NA; Custom_Duty: 15%; Customs_HS_Code: 85322990; Project: TI_MAXIE_CPB; Footprint Path: Y:\MIS_DATABASE\Library\ALTIUM_TOOL\PCB_FOOTPRINTS\Altium_Footprint_Lib.PcbLib; Library Path: Y:\MIS_DATABASE\Library\ALTIUM_TOOL\SCHEMATICS_PARTS\MS_DISCRETE_Library.schlib; Footprint Ref: CAP0201_0-5; MECHANICAL 3D STEP FILE: CAP0201_0-5; Temperature: -55°C+85°C; Weight: 0.33mg; Chkd/date: MANIRAJA/230118; Crtd /date: MANIRAJA/230118; Datasheet: Y:\MIS_DATABASE\DATASHEETS\CAPACITORS\GRM033R61E103KA12.PDF; Height: 0.33MM; Distributor_part_number: GRM033R61E103KA12J-ND; Distributor_name: DIGIKEY; Package: 0201; Voltage: 25V; Tolerance: 10%; Library Ref: CAP
C101 = CAP_Dup2: as C335 on sheet 18; PCB Footprint: CAP0402_0-75; Footprint Path: Y:\MIS_DATABASE\Library\ALTIUM_TOOL\PCB_FOOTPRINTS\Altium_Footprint_Lib.PcbLib; Library Path: Y:\MIS_DATABASE\Library\ALTIUM_TOOL\SCHEMATICS_PARTS\MS_DISCRETE_Library.schlib; Footprint Ref: CAP0402_0-75; Library Ref: CAP; MECHANICAL 3D STEP FILE: CAP0402_0-75; Chkd/date: MANIRAJA/261020; Crtd /date: ALVY/211020; Datasheet: Y:\MIS_DATABASE\DATASHEETS\CAPACITORS\GRM155R71H104KE14.PDF; Temperature: -55°C+125°C; Weight: 3.1mg; Height: 0.55MM; Distributor_part_number: 490-10700-1-ND; Distributor_name: DIGIKEY; Package: 0402; Voltage: 50V; Tolerance: 10%
C113 = CAP_Dup3: CAP CERAMIC 0.01uF 25V 10% X5R 0201; Mistral Part No: 120018010007-R; Mfr_name: MURATA; Mfr_part_number: GRM033R61E103KA12J; Part_type: CAPACITORS\CERAMIC; PCB Footprint: CAP0201_0-5; Project: TI_MAXIE_CPB; Customs_HS_Code: 85322990; Custom_Duty: 15%; Wattage: NA; Library Ref: CAP; Tolerance: 10%; Voltage: 25V; Package: 0201; Distributor_name: DIGIKEY; Distributor_part_number: GRM033R61E103KA12J-ND; Height: 0.33MM; Datasheet: Y:\MIS_DATABASE\DATASHEETS\CAPACITORS\GRM033R61E103KA12.PDF; Crtd /date: MANIRAJA/230118; Chkd/date: MANIRAJA/230118; Weight: 0.33mg; Temperature: -55°C+85°C; MECHANICAL 3D STEP FILE: CAP0201_0-5; Footprint Ref: CAP0201_0-5; Library Path: Y:\MIS_DATABASE\Library\ALTIUM_TOOL\SCHEMATICS_PARTS\MS_DISCRETE_Library.schlib; Footprint Path: Y:\MIS_DATABASE\Library\ALTIUM_TOOL\PCB_FOOTPRINTS\Altium_Footprint_Lib.PcbLib
R58 R63 R111 R114 R388 = RESISTOR_Dup6: as R427 on sheet 18; PCB Footprint: RES0201_0-5; Footprint Path: Y:\MIS_DATABASE\Library\ALTIUM_TOOL\PCB_FOOTPRINTS\Altium_Footprint_Lib.PcbLib; Library Path: Y:\MIS_DATABASE\Library\ALTIUM_TOOL\SCHEMATICS_PARTS\MS_DISCRETE_Library.schlib; MECHANICAL 3D STEP FILE: RES0201_0-5; Chkd/date: MANIRAJA/050517; Crtd /date: MANIRAJA/050517; Datasheet: Y:\MIS_DATABASE\DATASHEETS\RESISTORS\RCXXXXL-SER_MAR18.PDF; Temperature: -55°C+125°C; Weight: 0.17mg; Height: 0.26MM; Library Ref: RESISTOR; Distributor_part_number: 311-10KNCT-ND; Distributor_name: DIGIKEY; Package: 0201; Wattage: 1/20W; Tolerance: 5%; Footprint Ref: RES0201_0-5
R112 R140 = RESISTOR_Dup6: as R117 on sheet 19; PCB Footprint: RES0201_0-5; Footprint Ref: RES0201_0-5; Tolerance: 5%; Wattage: 1/20W; Package: 0201; Distributor_name: DIGIKEY; Distributor_part_number: 311-10KNCT-ND; Library Ref: RESISTOR; Height: 0.26MM; Weight: 0.17mg; Temperature: -55°C+125°C; Datasheet: Y:\MIS_DATABASE\DATASHEETS\RESISTORS\RCXXXXL-SER_MAR18.PDF; Crtd /date: MANIRAJA/050517; Chkd/date: MANIRAJA/050517; MECHANICAL 3D STEP FILE: RES0201_0-5; Library Path: Y:\MIS_DATABASE\Library\ALTIUM_TOOL\SCHEMATICS_PARTS\MS_DISCRETE_Library.schlib; Footprint Path: Y:\MIS_DATABASE\Library\ALTIUM_TOOL\PCB_FOOTPRINTS\Altium_Footprint_Lib.PcbLib
TP71 TP72 = TESTPOINT: TESTPOINT 0.56MM DRILL PTH; Mistral Part No: 130010010008; Mfr_name: LOCAL; Wattage: NA; Project: KOPIN_MODULS; PCB Footprint: TP_36X22; Temperature: NA; Weight: NA; Voltage: NA; Tolerance: NA; Mfr_part_number: TP_36X22; Part_type: TESTPOINT; Package: THRU-HOLE; Distributor_name: NA; Distributor_part_number: NA; Height: NA; Crtd /date: MAZHAR/110405; Chkd/date: BAVISH/040311; Datasheet: NA; Library Ref: TESTPOINT
U11 = TMP100NA/3K_SOT23-6: IC TEMPERATURE SENSOR WITH I2C AND SMBUS INTERFACE SOT23-6; Mistral Part No: 141017080030-R; Mfr_name: TEXAS INSTRUMENTS; Part_type: ICS\DIGITAL\PERIPHERAL; Project: TI_MAXIE_CPB; Tolerance: NA; Customs_HS_Code: 85423100; Custom_Duty: 15%; PCB Footprint: SOT23-6_1-5; Library Ref: TMP100NA/3K_SOT23-6; Mfr_part_number: TMP100NA/3K; Voltage: NA; Wattage: NA; Package: SOT23-6; Distributor_name: DIGIKEY; Distributor_part_number: 296-26833-1-ND; Height: 1.45MM; Weight: 120mg; Temperature: -55°C+125°C; Datasheet: Y:\MIS_DATABASE\DATASHEETS\ICS\DIGITAL\PERIPHERAL\TMP10XX.PDF; Crtd /date: MANIRAJA/290817; Chkd/date: MANIRAJA/290817; MECHANICAL 3D STEP FILE: SOT23-6_1-5
U26 = AT24C64D-MAHM-T_UDFN8: IC 1.7-3.6V 512Kb I2C COMPATIBLE SERIAL EEPROM UDFN8; Mistral Part No: 141119090004-R; Mfr_name: MICROCHIP; Part_type: ICS\DIGITAL\MEMORY; Project: HAL_3U-T1042-SBC; Tolerance: NA; Customs_HS_Code: 85423100; Custom_Duty: 15%; PCB Footprint: UDFN8_19-68_120X80_0-6; Mfr_part_number: AT24C512C-MAHM-T; Voltage: NA; Wattage: NA; Package: UDFN8; Distributor_name: DIGIKEY; Distributor_part_number: AT24C512C-MAHM-TCT-ND; Library Ref: AT24C64D-MAHM-T_UDFN8; Footprint Ref: UDFN8_19-68_120X80_0-6; Height: 0.60MM; Weight: 9.5mg; Temperature: -40°C+85°C; Datasheet: Y:\MIS_DATABASE\DATASHEETS\ICS\MEMORY\AT24C512C.PDF; Crtd /date: ALVY/240919; Chkd/date: MANIRAJA/240919; MECHANICAL 3D STEP FILE: UDFN8_19-68_120X80_0-6; Library Path: Y:\MIS_DATABASE\Library\ALTIUM_TOOL\SCHEMATICS_PARTS\MS_MISCMEMORY_Library.schlib; Footprint Path: Y:\MIS_DATABASE\Library\ALTIUM_TOOL\PCB_FOOTPRINTS\Altium_Footprint_Lib.PcbLib
U33 = TMP100NA/3K_SOT23-6: IC TEMPERATURE SENSOR WITH I2C AND SMBUS INTERFACE SOT23-6; Part_type: ICS\DIGITAL\PERIPHERAL; Mfr_name: TEXAS INSTRUMENTS; Mistral Part No: 141017080030-R; Custom_Duty: 15%; Customs_HS_Code: 85423100; Wattage: NA; Project: TI_MAXIE_CPB; PCB Footprint: SOT23-6_1-5; Library Ref: TMP100NA/3K_SOT23-6; MECHANICAL 3D STEP FILE: SOT23-6_1-5; Chkd/date: MANIRAJA/290817; Crtd /date: MANIRAJA/290817; Datasheet: Y:\MIS_DATABASE\DATASHEETS\ICS\DIGITAL\PERIPHERAL\TMP10XX.PDF; Temperature: -55°C+125°C; Weight: 120mg; Height: 1.45MM; Distributor_part_number: 296-26833-1-ND; Distributor_name: DIGIKEY; Package: SOT23-6; Voltage: NA; Tolerance: NA; Mfr_part_number: TMP100NA/3K